# Altium schematic sheet ActuatedFin_v1.SchDoc
size A; SheetNumber: 1; SheetTotal: 1
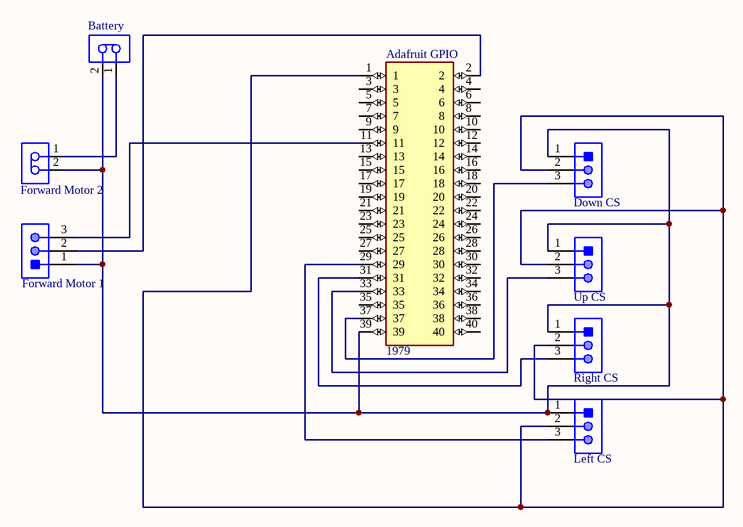
[diagram p0: ActuatedFin_v1.SchDoc]

## Parts
Adafruit_GPIO  1979  [RHDR40W60P250_2X20_5100X500X23]
Battery  B2B-PH-K-S(LF)(SN)  [JST-B2B-PH-K-S_V]  (value not drawn)
Down_CS  B3B-PH-K-S(LF)(SN)  [JST-B3B-PH-K-S-3_V]  (value not drawn)
Forward_Motor_1  B3B-PH-K-S(LF)(SN)  [JST-B3B-PH-K-S-3_V]  (value not drawn)
Forward_Motor_2  B2B-PH-K-S(LF)(SN)  [JST-B2B-PH-K-S_V]  (value not drawn)
Left_CS  B3B-PH-K-S(LF)(SN)  [JST-B3B-PH-K-S-3_V]  (value not drawn)
Right_CS  B3B-PH-K-S(LF)(SN)  [JST-B3B-PH-K-S-3_V]  (value not drawn)
Up_CS  B3B-PH-K-S(LF)(SN)  [JST-B3B-PH-K-S-3_V]  (value not drawn)

## Nets
NetAdafruit_GPIO_1: Adafruit_GPIO.1 Down_CS.2 Left_CS.2 Right_CS.2 Up_CS.2
NetAdafruit_GPIO_2: Adafruit_GPIO.2 Forward_Motor_1.2
NetAdafruit_GPIO_11: Adafruit_GPIO.11 Forward_Motor_1.3
NetAdafruit_GPIO_29: Adafruit_GPIO.29 Left_CS.3
NetAdafruit_GPIO_31: Adafruit_GPIO.31 Right_CS.3
NetAdafruit_GPIO_33: Adafruit_GPIO.33 Up_CS.3
NetAdafruit_GPIO_37: Adafruit_GPIO.37 Down_CS.3
NetAdafruit_GPIO_39: Adafruit_GPIO.39 Battery.2 Down_CS.1 Forward_Motor_1.1 Forward_Motor_2.2 Left_CS.1 Right_CS.1 Up_CS.1
NetBattery_1: Battery.1 Forward_Motor_2.1

Not connected (* = marked no-connect by the designer): Adafruit_GPIO 3 4 5 6 7 8 9 10 12 13 14 15 16 17 18 19 20 21 22 23 24 25 26 27 28 30 32 34 35 36 38 40

## Library data of the parts
Adafruit_GPIO = CMP-002-00071-1: Stacking Header for Pi A+/B+/Pi 2/Pi 3 - 2x20 Extra Tall Header; MF: Adafruit Industries; Pins: 40; MP: 1979; SnapEDA_Link: https://www.snapeda.com/parts/1979/Adafruit+Industries+LLC/view-part/?ref=snap; Source: 1979.SchLib; Design Item ID: 1979; Value: *; Check_prices: https://www.snapeda.com/parts/1979/Adafruit+Industries+LLC/view-part/?ref=eda; Case/Package: None; Component Type: Standard
Battery Forward_Motor_2 = CMP-2000-05162-1: Male Header, Pitch 2 mm, 1 x 2 Position, Height 6 mm, Tail Length 3.4 mm, -25 to 85 degC, RoHS, Bulk; Manufacturer: JST; Pitch: 2mm; Style/Orientation: StraightHeader/Plug; No of Positions: 2; Datasheet Version: Nov-08; Datasheet URL: http://datasheet.octopart.com/B2B-PH-K-S%28LF%29%28SN%29-JST-datasheet-8324864.pdf; Manufacturer URL: http://www.jst.com/home2.html; Type: ShroudedHeader; Termination: Crimp
Down_CS Forward_Motor_1 Left_CS Right_CS Up_CS = CMP-2000-05164-1: Male Header, Pitch 2 mm, 1 x 3 Position, Height 6 mm, Tail Length 3.4 mm, -25 to 85 degC, RoHS, Bulk; Manufacturer: JST; Style/Orientation: StraightHeader/Plug; Pitch: 2mm; No of Positions: 3; Termination: Crimp; Manufacturer URL: http://www.jst.com/home2.html; Datasheet Version: Oct-06; Type: ShroudedHeader; Datasheet URL: https://datasheet.ciiva.com/11746/0900766b80826550-11746939.pdf